# Altium schematic sheet SH7 - M.2 E-KEY.SchDoc: Jetson AGX Xavier Carrier Board - M.2 E-Key
size B; Engineer: Cindy Li, Chealsie Bains; Organization: UW Robotics; Address1: 200 University Avenue; Address2: Waterloo; Address3: Ontario; Address4: Canada N2L 3G6; DocumentNumber: 7; Revision: 1; SheetNumber: 7; SheetTotal: 12
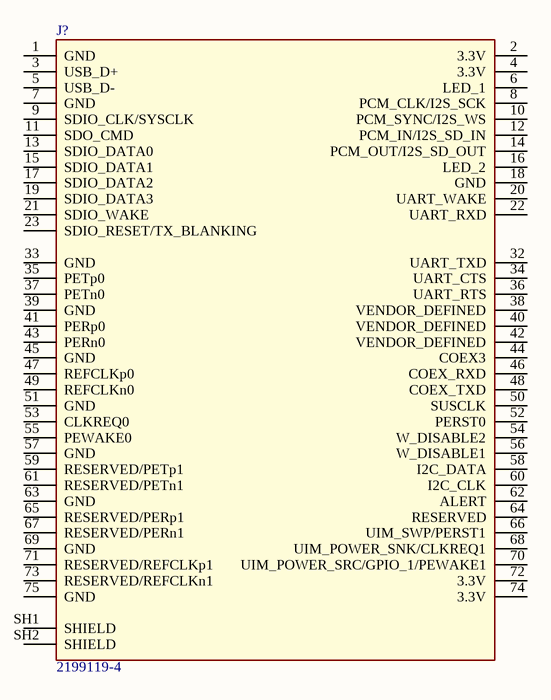
[diagram p0: SH7 - M.2 E-KEY.SchDoc]

## Parts
J?  2199119-4  [TE_2199119-4]

## Nets

Not connected (* = marked no-connect by the designer): J? 1(GND) 2(3.3V) 3(USB_D+) 4(3.3V) 5(USB_D-) 6(LED_1) 7(GND) 8(PCM_CLK/I2S_SCK) 9(SDIO_CLK/SYSCLK) 10(PCM_SYNC/I2S_WS) 11(SDO_CMD) 12(PCM_IN/I2S_SD_IN) 13(SDIO_DATA0) 14(PCM_OUT/I2S_SD_OUT) 15(SDIO_DATA1) 16(LED_2) 17(SDIO_DATA2) 18(GND) 19(SDIO_DATA3) 20(UART_WAKE) 21(SDIO_WAKE) 22(UART_RXD) 23(SDIO_RESET/TX_BLANKING) 32(UART_TXD) 33(GND) 34(UART_CTS) 35(PETp0) 36(UART_RTS) 37(PETn0) 38(VENDOR_DEFINED) 39(GND) 40(VENDOR_DEFINED) 41(PERp0) 42(VENDOR_DEFINED) 43(PERn0) 44(COEX3) 45(GND) 46(COEX_RXD) 47(REFCLKp0) 48(COEX_TXD) 49(REFCLKn0) 50(SUSCLK) 51(GND) 52(PERST0) 53(CLKREQ0) 54(W_DISABLE2) 55(PEWAKE0) 56(W_DISABLE1) 57(GND) 58(I2C_DATA) 59(RESERVED/PETp1) 60(I2C_CLK) 61(RESERVED/PETn1) 62(ALERT) 63(GND) 64(RESERVED) 65(RESERVED/PERp1) 66(UIM_SWP/PERST1) 67(RESERVED/PERn1) 68(UIM_POWER_SNK/CLKREQ1) 69(GND) 70(UIM_POWER_SRC/GPIO_1/PEWAKE1) 71(RESERVED/REFCLKp1) 72(3.3V) 73(RESERVED/REFCLKn1) 74(3.3V) 75(GND) SH1(SHIELD) SH2(SHIELD)

## Notes on the sheet
- Title:
- Project:
- Date:
- Rev:
- Reviewer:
- Engineer:
- Sheet:
- of

## Library data of the parts
J? = 2199119-4: CONN M.2 FEMALE 67POS 0.020 GOLD; Manufacturer 1: TE Connectivity; Number of Positions: 67; Pitch: 0.020" (0.50mm); Supplier 1: Digi-Key; Supplier Part Number 1: A115900CT-ND; Gender: Female; Manufacturer Part Number 1: 2199119-4